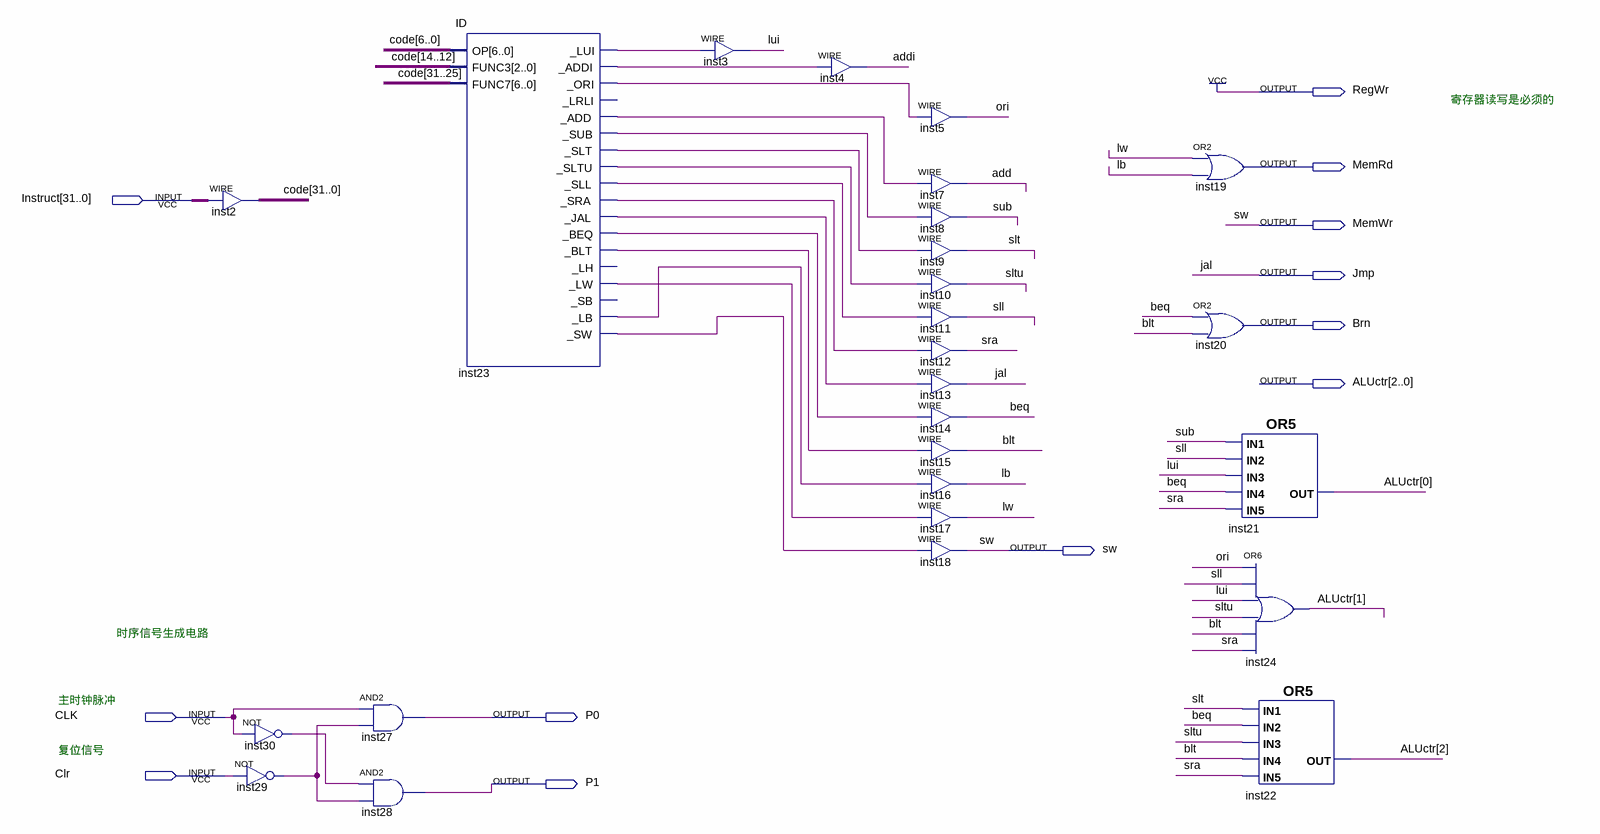
[diagram p0: schematic sheet]
// Quartus schematic CU.bdf as structural Verilog: 26 symbols, 12 pins
module CU (
  input  [31:0] Instruct,
  input  CLK,
  input  Clr,
  output RegWr,
  output MemRd,
  output MemWr,
  output Jmp,
  output Brn,
  output [2:0] ALUctr,
  output sw,
  output P0,
  output P1
);

  wire add, addi, beq, blt, inst23__add, inst23__addi, inst23__beq, inst23__blt, inst23__jal, inst23__lb,
       inst23__lui, inst23__lw, inst23__ori, inst23__sll, inst23__slt, inst23__sltu, inst23__sra,
       inst23__sub, inst23__sw, inst29_out, inst30_out, lb, lui, lw, ori, sll, slt, sltu, sra, sub;
  wire [31:0] code;

  assign code = Instruct;  // WIRE inst2
  not inst29 (inst29_out, Clr);
  not inst30 (inst30_out, CLK);
  and inst27 (P0, CLK, inst29_out);
  and inst28 (P1, inst30_out, inst29_out);
  ID inst23 (
    .OP(code[6:0]), .FUNC3(code[14:12]), .FUNC7(code[31:25]), ._LUI(inst23__lui), ._ADDI(inst23__addi),
    ._ORI(inst23__ori), ._ADD(inst23__add), ._SUB(inst23__sub), ._SLT(inst23__slt), ._SLTU(inst23__sltu),
    ._SLL(inst23__sll), ._SRA(inst23__sra), ._JAL(inst23__jal), ._BEQ(inst23__beq), ._BLT(inst23__blt),
    ._LW(inst23__lw), ._LB(inst23__lb), ._SW(inst23__sw));  // open: _LRLI, _LH, _SB
  assign lui = inst23__lui;  // WIRE inst3
  assign addi = inst23__addi;  // WIRE inst4
  assign ori = inst23__ori;  // WIRE inst5
  assign add = inst23__add;  // WIRE inst7
  assign sub = inst23__sub;  // WIRE inst8
  assign slt = inst23__slt;  // WIRE inst9
  assign sltu = inst23__sltu;  // WIRE inst10
  assign sll = inst23__sll;  // WIRE inst11
  assign sra = inst23__sra;  // WIRE inst12
  assign Jmp = inst23__jal;  // WIRE inst13
  assign beq = inst23__beq;  // WIRE inst14
  assign blt = inst23__blt;  // WIRE inst15
  assign lb = inst23__lb;  // WIRE inst16
  assign lw = inst23__lw;  // WIRE inst17
  assign MemWr = inst23__sw;  // WIRE inst18
  or inst19 (MemRd, lw, lb);
  or inst20 (Brn, beq, blt);
  or inst21 (ALUctr[0], sub, sll, lui, beq, sra);
  or inst24 (ALUctr[1], ori, sll, lui, sltu, blt, sra);
  or inst22 (ALUctr[2], slt, beq, sltu, blt, sra);

  assign RegWr = 1'b1;
  assign sw = MemWr;

  // Other names for the same wires on the sheet: jal = Jmp

  // Notes on the sheet:
  //   寄存器读写是必须的
  //   时序信号生成电路
  //   主时钟脉冲
  //   复位信号
endmodule
